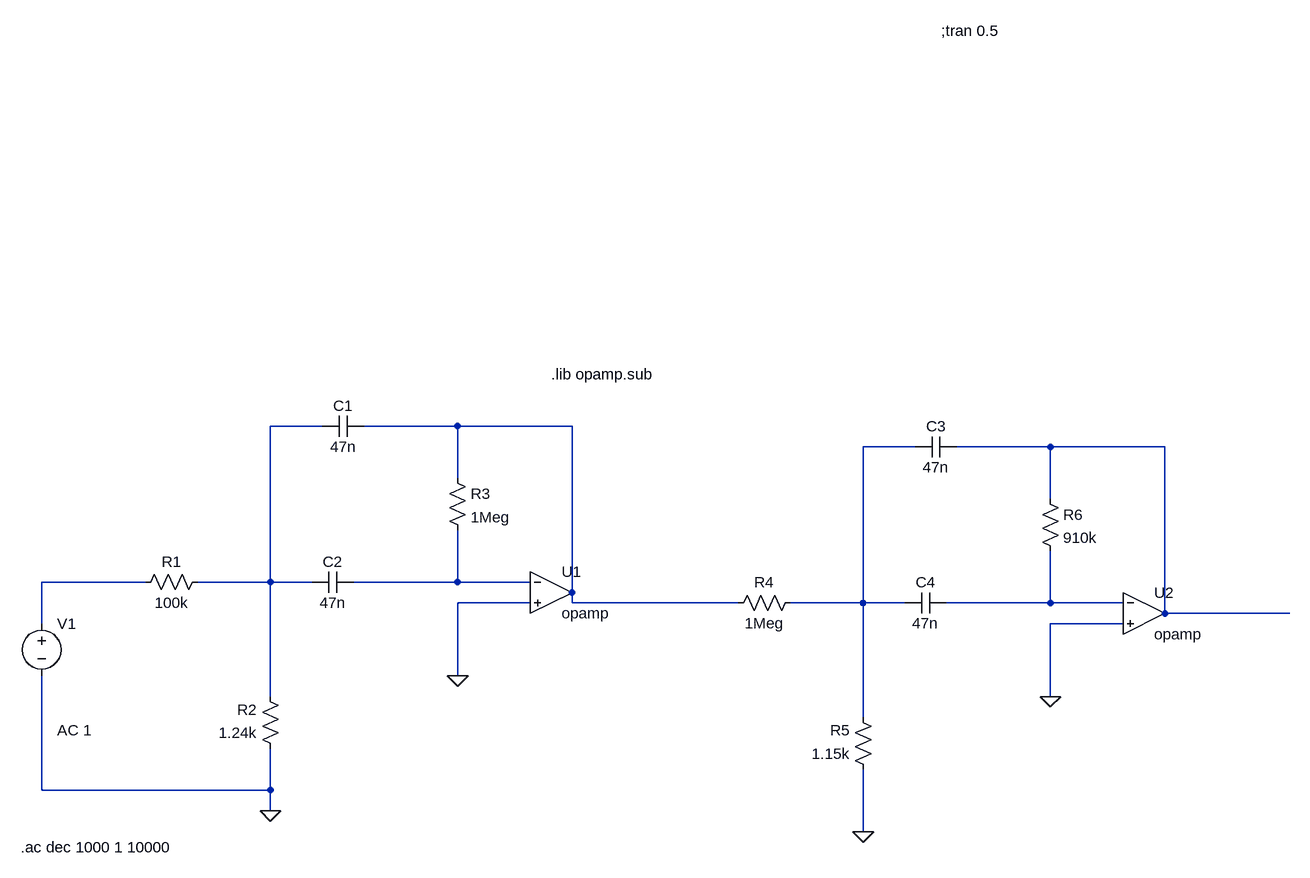
[diagram p0: schematic adcValoresExactos.asc]
adcValoresExactos.asc, the LTspice schematic file:
Version 4
SHEET 1 2324 680
WIRE 320 -224 240 -224
WIRE 528 -224 384 -224
WIRE 704 -224 528 -224
WIRE 1232 -192 1152 -192
WIRE 1440 -192 1296 -192
WIRE 1616 -192 1440 -192
WIRE 528 -144 528 -224
WIRE 1440 -112 1440 -192
WIRE 48 16 -112 16
WIRE 240 16 240 -224
WIRE 240 16 128 16
WIRE 304 16 240 16
WIRE 528 16 528 -64
WIRE 528 16 368 16
WIRE 640 16 528 16
WIRE 704 32 704 -224
WIRE 640 48 528 48
WIRE 704 48 704 32
WIRE 960 48 704 48
WIRE 1152 48 1152 -192
WIRE 1152 48 1040 48
WIRE 1216 48 1152 48
WIRE 1440 48 1440 -32
WIRE 1440 48 1280 48
WIRE 1552 48 1440 48
WIRE 1616 64 1616 -192
WIRE 1808 64 1616 64
WIRE -112 80 -112 16
WIRE 1552 80 1440 80
WIRE 528 160 528 48
WIRE 240 192 240 16
WIRE 1440 192 1440 80
WIRE 1152 224 1152 48
WIRE -112 336 -112 160
WIRE 240 336 240 272
WIRE 240 336 -112 336
WIRE 240 368 240 336
WIRE 1152 400 1152 304
FLAG 240 368 0
FLAG 528 160 0
FLAG 1152 400 0
FLAG 1440 192 0
SYMBOL res 144 0 R90
WINDOW 0 0 56 VBottom 2
WINDOW 3 32 56 VTop 2
SYMATTR InstName R1
SYMATTR Value 100k
SYMATTR SpiceLine tol=10
SYMBOL res 256 288 R180
WINDOW 0 36 76 Left 2
WINDOW 3 36 40 Left 2
SYMATTR InstName R2
SYMATTR Value 1.24k
SYMATTR SpiceLine tol=1
SYMBOL res 512 -160 R0
SYMATTR InstName R3
SYMATTR Value 1Meg
SYMATTR SpiceLine tol=10
SYMBOL cap 384 -240 R90
WINDOW 0 0 32 VBottom 2
WINDOW 3 32 32 VTop 2
SYMATTR InstName C1
SYMATTR Value 47n
SYMBOL cap 368 0 R90
WINDOW 0 0 32 VBottom 2
WINDOW 3 32 32 VTop 2
SYMATTR InstName C2
SYMATTR Value 47n
SYMBOL OpAmps\\opamp 672 -32 R0
SYMATTR InstName U1
SYMBOL voltage -112 64 R0
WINDOW 123 24 180 Left 2
WINDOW 39 0 0 Left 0
WINDOW 3 24 152 Left 2
SYMATTR Value2 AC 1
SYMATTR Value ""
SYMATTR InstName V1
SYMBOL res 1056 32 R90
WINDOW 0 0 56 VBottom 2
WINDOW 3 32 56 VTop 2
SYMATTR InstName R4
SYMATTR Value 1Meg
SYMATTR SpiceLine tol=10
SYMBOL res 1168 320 R180
WINDOW 0 36 76 Left 2
WINDOW 3 36 40 Left 2
SYMATTR InstName R5
SYMATTR Value 1.15k
SYMATTR SpiceLine tol=2
SYMBOL res 1424 -128 R0
SYMATTR InstName R6
SYMATTR Value 910k
SYMATTR SpiceLine tol=5
SYMBOL cap 1296 -208 R90
WINDOW 0 0 32 VBottom 2
WINDOW 3 32 32 VTop 2
SYMATTR InstName C3
SYMATTR Value 47n
SYMBOL cap 1280 32 R90
WINDOW 0 0 32 VBottom 2
WINDOW 3 32 32 VTop 2
SYMATTR InstName C4
SYMATTR Value 47n
SYMBOL OpAmps\\opamp 1584 0 R0
SYMATTR InstName U2
TEXT -144 424 Left 2 !.ac dec 1000 1 10000
TEXT 672 -304 Left 2 !.lib opamp.sub
TEXT 1272 -832 Left 2 !;tran 0.5

The netlist it stands for:
* adcValoresExactos.asc
R1 N001 N005 100k tol=10
R2 0 N001 1.24k tol=1
R3 N002 N006 1Meg tol=10
C1 N002 N001 47n
C2 N006 N001 47n
XU1 N006 0 N002 opamp Aol=100K GBW=10Meg  ; pins invin noninvin out
V1 N005 0 AC 1
R4 N003 N002 1Meg tol=10
R5 0 N003 1.15k tol=2
R6 N004 N007 910k tol=5
C3 N004 N003 47n
C4 N007 N003 47n
XU2 N007 0 N004 opamp Aol=100K GBW=10Meg  ; pins invin noninvin out
.ac dec 1000 1 10000
.lib opamp.sub
;tran 0.5
.backanno
.end